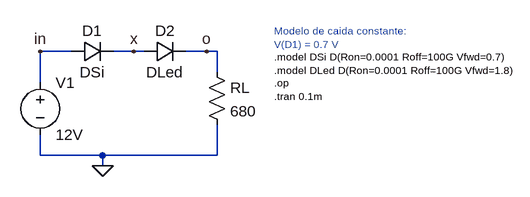
[diagram p0: schematic ejemplo4_caida-constante.asc]
ejemplo4_caida-constante.asc, the LTspice schematic file:
Version 4
SHEET 1 1376 680
WIRE -96 32 -144 32
WIRE 0 32 -32 32
WIRE 16 32 0 32
WIRE 112 32 80 32
WIRE 128 32 112 32
WIRE 128 64 128 32
WIRE -144 80 -144 32
WIRE -144 192 -144 160
WIRE -48 192 -144 192
WIRE 128 192 128 144
WIRE 128 192 -48 192
WIRE -48 208 -48 192
FLAG -48 208 0
FLAG -144 32 in
FLAG 112 32 o
FLAG 0 32 x
SYMBOL diode -96 48 R270
WINDOW 0 32 32 VTop 2
WINDOW 3 0 32 VBottom 2
SYMATTR InstName D1
SYMATTR Value DSi
SYMBOL voltage -144 64 R0
WINDOW 123 0 0 Left 0
WINDOW 39 0 0 Left 0
SYMATTR InstName V1
SYMATTR Value 12V
SYMBOL res 112 48 R0
SYMATTR InstName RL
SYMATTR Value 680
SYMBOL diode 16 48 R270
WINDOW 0 32 32 VTop 2
WINDOW 3 0 32 VBottom 2
SYMATTR InstName D2
SYMATTR Value DLed
TEXT 216 80 Left 1 !.op\n.tran 0.1m
TEXT 216 40 Left 1 !.model DSi D(Ron=0.0001 Roff=100G Vfwd=0.7)\n.model DLed D(Ron=0.0001 Roff=100G Vfwd=1.8)
TEXT 216 0 Left 1 ;Modelo de caida constante:\nV(D1) = 0.7 V

The netlist it stands for:
* ejemplo4_caida-constante.asc
D1 in x DSi
V1 in 0 12V
RL o 0 680
D2 x o DLed
.model D D
.lib standard.dio
.op
.tran 0.1m
.model DSi D(Ron=0.0001 Roff=100G Vfwd=0.7)
.model DLed D(Ron=0.0001 Roff=100G Vfwd=1.8)
* Modelo de caida constante:
* V(D1) = 0.7 V
.backanno
.end